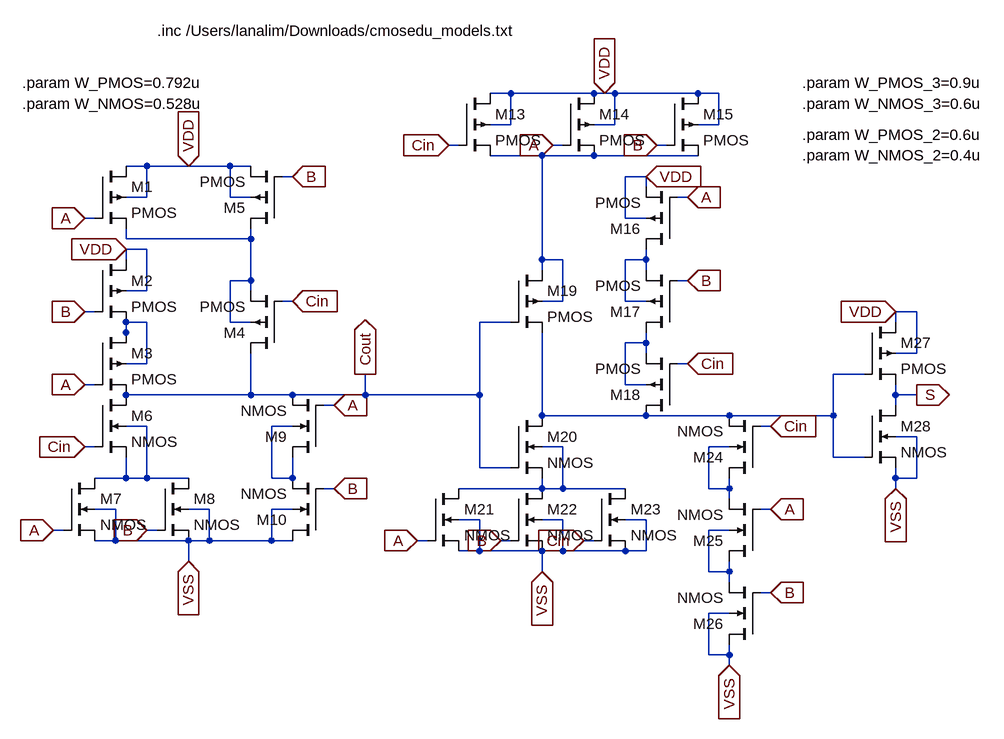
[diagram p0: schematic full_adder_2_even.asc]
full_adder_2_even.asc, the LTspice schematic file:
Version 4
SHEET 1 1372 1088
WIRE 448 -96 416 -96
WIRE 576 -96 448 -96
WIRE 592 -96 576 -96
WIRE 608 -96 592 -96
WIRE 736 -96 608 -96
WIRE 768 -96 736 -96
WIRE 448 -48 448 -96
WIRE 448 -48 416 -48
WIRE 608 -48 608 -96
WIRE 608 -48 576 -48
WIRE 768 -48 768 -96
WIRE 768 -48 736 -48
WIRE 368 -16 352 -16
WIRE 528 -16 512 -16
WIRE 688 -16 672 -16
WIRE 496 0 416 0
WIRE 576 0 496 0
WIRE 736 0 576 0
WIRE -112 16 -144 16
WIRE -48 16 -112 16
WIRE 16 16 -48 16
WIRE 48 16 16 16
WIRE 112 32 96 32
WIRE 656 32 624 32
WIRE 656 48 656 32
WIRE -112 64 -112 16
WIRE -112 64 -144 64
WIRE 16 64 16 16
WIRE 48 64 16 64
WIRE 720 64 704 64
WIRE -192 96 -208 96
WIRE 624 96 624 32
WIRE 656 96 624 96
WIRE -144 128 -144 112
WIRE 48 128 48 112
WIRE 48 128 -144 128
WIRE -112 144 -144 144
WIRE -144 160 -144 144
WIRE 496 160 496 0
WIRE 528 160 496 160
WIRE 656 160 656 144
WIRE 656 160 624 160
WIRE 496 176 496 160
WIRE 656 176 656 160
WIRE 48 192 48 128
WIRE 48 192 16 192
WIRE 720 192 704 192
WIRE -112 208 -112 144
WIRE -112 208 -144 208
WIRE 48 208 48 192
WIRE 112 224 96 224
WIRE 528 224 528 160
WIRE 528 224 496 224
WIRE 624 224 624 160
WIRE 656 224 624 224
WIRE -192 240 -208 240
WIRE 1072 240 1040 240
WIRE -112 256 -144 256
WIRE 16 256 16 192
WIRE 48 256 16 256
WIRE 448 256 400 256
WIRE 1040 256 1040 240
WIRE -144 272 -144 256
WIRE -144 288 -144 272
WIRE 656 288 656 272
WIRE 656 288 624 288
WIRE 656 304 656 288
WIRE 1072 304 1072 240
WIRE 1072 304 1040 304
WIRE -112 320 -112 256
WIRE -112 320 -144 320
WIRE 720 320 704 320
WIRE 992 336 944 336
WIRE -192 352 -208 352
WIRE 624 352 624 288
WIRE 656 352 624 352
WIRE 48 368 48 304
WIRE 48 368 -144 368
WIRE 112 368 48 368
WIRE 224 368 224 336
WIRE 224 368 112 368
WIRE 400 368 400 256
WIRE 400 368 224 368
WIRE 1040 368 1040 352
WIRE 1072 368 1040 368
WIRE 176 384 160 384
WIRE 1040 384 1040 368
WIRE 496 400 496 272
WIRE 656 400 496 400
WIRE 784 400 656 400
WIRE 944 400 944 336
WIRE 944 400 784 400
WIRE -112 416 -144 416
WIRE 112 416 80 416
WIRE 848 416 832 416
WIRE 1072 432 1040 432
WIRE -192 448 -208 448
WIRE 528 448 496 448
WIRE 784 448 752 448
WIRE 944 464 944 400
WIRE 992 464 944 464
WIRE 400 480 400 368
WIRE 448 480 400 480
WIRE -144 496 -144 464
WIRE -144 496 -192 496
WIRE -112 496 -112 416
WIRE -112 496 -144 496
WIRE -48 496 -112 496
WIRE 80 496 80 416
WIRE 112 496 112 464
WIRE 112 496 80 496
WIRE 1040 496 1040 480
WIRE 1072 496 1072 432
WIRE 1072 496 1040 496
WIRE 176 512 160 512
WIRE 496 512 496 496
WIRE 496 512 368 512
WIRE 528 512 528 448
WIRE 528 512 496 512
WIRE 624 512 528 512
WIRE 752 512 752 448
WIRE 784 512 784 496
WIRE 784 512 752 512
WIRE 1040 512 1040 496
WIRE 784 528 784 512
WIRE -160 544 -192 544
WIRE -16 544 -48 544
WIRE 112 544 80 544
WIRE 848 544 832 544
WIRE 400 560 368 560
WIRE 528 560 496 560
WIRE 656 560 624 560
WIRE -240 576 -256 576
WIRE -96 576 -112 576
WIRE 784 576 752 576
WIRE -160 592 -160 544
WIRE -160 592 -192 592
WIRE -48 592 -160 592
WIRE -16 592 -16 544
WIRE -16 592 -48 592
WIRE 80 592 80 544
WIRE 80 592 -16 592
WIRE 112 592 80 592
WIRE 320 592 304 592
WIRE 448 592 432 592
WIRE 576 592 560 592
WIRE 400 608 400 560
WIRE 400 608 368 608
WIRE 496 608 400 608
WIRE 528 608 528 560
WIRE 528 608 496 608
WIRE 624 608 528 608
WIRE 656 608 656 560
WIRE 656 608 624 608
WIRE -48 624 -48 592
WIRE 496 640 496 608
WIRE 752 640 752 576
WIRE 784 640 784 624
WIRE 784 640 752 640
WIRE 784 656 784 640
WIRE 848 672 832 672
WIRE 784 704 752 704
WIRE 752 768 752 704
WIRE 784 768 784 752
WIRE 784 768 752 768
WIRE 784 784 784 768
FLAG 592 -96 VDD
IOPIN 592 -96 In
FLAG 1040 240 VDD
IOPIN 1040 240 In
FLAG 1072 368 S
IOPIN 1072 368 Out
FLAG 352 -16 Cin
IOPIN 352 -16 In
FLAG 512 -16 A
IOPIN 512 -16 In
FLAG 672 -16 B
IOPIN 672 -16 In
FLAG 720 64 A
IOPIN 720 64 In
FLAG 720 192 B
IOPIN 720 192 In
FLAG 720 320 Cin
IOPIN 720 320 In
FLAG 304 592 A
IOPIN 304 592 In
FLAG 432 592 B
IOPIN 432 592 In
FLAG 560 592 Cin
IOPIN 560 592 In
FLAG 848 416 Cin
IOPIN 848 416 In
FLAG 848 544 A
IOPIN 848 544 In
FLAG 848 672 B
IOPIN 848 672 In
FLAG -208 96 A
IOPIN -208 96 In
FLAG -208 240 B
IOPIN -208 240 In
FLAG -208 352 A
IOPIN -208 352 In
FLAG 112 32 B
IOPIN 112 32 In
FLAG 112 224 Cin
IOPIN 112 224 In
FLAG -48 16 VDD
IOPIN -48 16 In
FLAG -208 448 Cin
IOPIN -208 448 In
FLAG -256 576 A
IOPIN -256 576 In
FLAG -112 576 B
IOPIN -112 576 In
FLAG 176 512 B
IOPIN 176 512 In
FLAG 176 384 A
IOPIN 176 384 In
FLAG 224 336 Cout
IOPIN 224 336 Out
FLAG -48 624 VSS
IOPIN -48 624 In
FLAG 496 640 VSS
IOPIN 496 640 In
FLAG 784 784 VSS
IOPIN 784 784 In
FLAG 1040 512 VSS
IOPIN 1040 512 In
FLAG -144 144 VDD
IOPIN -144 144 In
FLAG 656 32 VDD
IOPIN 656 32 In
SYMBOL pmos4 368 -96 R0
SYMATTR InstName M13
SYMATTR Value2 l=1e-7 w={W_PMOS_2}
SYMBOL pmos4 528 -96 R0
SYMATTR InstName M14
SYMATTR Value2 l=1e-7 w={W_PMOS_2}
SYMBOL pmos4 688 -96 R0
SYMATTR InstName M15
SYMATTR Value2 l=1e-7 w={W_PMOS_2}
SYMBOL pmos4 704 144 R180
SYMATTR InstName M16
SYMATTR Value2 l=1e-7 w={W_PMOS_3}
SYMBOL pmos4 704 272 R180
SYMATTR InstName M17
SYMATTR Value2 l=1e-7 w={W_PMOS_3}
SYMBOL pmos4 704 400 R180
SYMATTR InstName M18
SYMATTR Value2 l=1e-7 w={W_PMOS_3}
SYMBOL pmos4 448 176 R0
SYMATTR InstName M19
SYMATTR Value2 l=1e-7 w={W_PMOS_2}
SYMBOL nmos4 448 400 R0
SYMATTR InstName M20
SYMATTR Value2 l=1e-7 w={W_NMOS_2}
SYMBOL nmos4 320 512 R0
SYMATTR InstName M21
SYMATTR Value2 l=1e-7 w={W_NMOS_2}
SYMBOL nmos4 448 512 R0
SYMATTR InstName M22
SYMATTR Value2 l=1e-7 w={W_NMOS_2}
SYMBOL nmos4 576 512 R0
SYMATTR InstName M23
SYMATTR Value2 l=1e-7 w={W_NMOS_2}
SYMBOL nmos4 832 496 R180
SYMATTR InstName M24
SYMATTR Value2 l=1e-7 w={W_NMOS_3}
SYMBOL nmos4 832 624 R180
SYMATTR InstName M25
SYMATTR Value2 l=1e-7 w={W_NMOS_3}
SYMBOL nmos4 832 752 R180
SYMATTR InstName M26
SYMATTR Value2 l=1e-7 w={W_NMOS_3}
SYMBOL pmos4 992 256 R0
SYMATTR InstName M27
SYMATTR Value2 l=1e-7 w=1045e-9
SYMBOL nmos4 992 384 R0
SYMATTR InstName M28
SYMATTR Value2 l=1e-7 w=696e-9
SYMBOL pmos4 -192 16 R0
SYMATTR InstName M1
SYMATTR Value2 l=1e-7 w={W_PMOS}
SYMBOL pmos4 -192 160 R0
SYMATTR InstName M2
SYMATTR Value2 l=1e-7 w={W_PMOS}
SYMBOL pmos4 -192 272 R0
SYMATTR InstName M3
SYMATTR Value2 l=1e-7 w={W_PMOS}
SYMBOL pmos4 96 304 R180
SYMATTR InstName M4
SYMATTR Value2 l=1e-7 w={W_PMOS}
SYMBOL pmos4 96 112 R180
SYMATTR InstName M5
SYMATTR Value2 l=1e-7 w={W_PMOS}
SYMBOL nmos4 -192 368 R0
SYMATTR InstName M6
SYMATTR Value2 l=1e-7 w={W_NMOS}
SYMBOL nmos4 -240 496 R0
SYMATTR InstName M7
SYMATTR Value2 l=1e-7 w={W_NMOS}
SYMBOL nmos4 -96 496 R0
SYMATTR InstName M8
SYMATTR Value2 l=1e-7 w={W_NMOS}
SYMBOL nmos4 160 464 R180
SYMATTR InstName M9
SYMATTR Value2 l=1e-7 w={W_NMOS}
SYMBOL nmos4 160 592 R180
SYMATTR InstName M10
SYMATTR Value2 l=1e-7 w={W_NMOS}
TEXT -96 -192 Left 2 !.inc /Users/lanalim/Downloads/cmosedu_models.txt
TEXT -304 -112 Left 2 !.param W_PMOS=0.792u
TEXT -304 -80 Left 2 !.param W_NMOS=0.528u
TEXT 896 -112 Left 2 !.param W_PMOS_3=0.9u
TEXT 896 -80 Left 2 !.param W_NMOS_3=0.6u
TEXT 896 -32 Left 2 !.param W_PMOS_2=0.6u\n.param W_NMOS_2=0.4u

The netlist it stands for:
* full_adder_2_even.asc
M13 VDD Cin N001 VDD PMOS l=1e-7 w={W_PMOS_2}
M14 VDD A N001 VDD PMOS l=1e-7 w={W_PMOS_2}
M15 VDD B N001 VDD PMOS l=1e-7 w={W_PMOS_2}
M16 N003 A VDD VDD PMOS l=1e-7 w={W_PMOS_3}
M17 N005 B N003 N003 PMOS l=1e-7 w={W_PMOS_3}
M18 N006 Cin N005 N005 PMOS l=1e-7 w={W_PMOS_3}
M19 N001 Cout N006 N001 PMOS l=1e-7 w={W_PMOS_2}
M20 N006 Cout N009 N009 NMOS l=1e-7 w={W_NMOS_2}
M21 N009 A VSS VSS NMOS l=1e-7 w={W_NMOS_2}
M22 N009 B VSS VSS NMOS l=1e-7 w={W_NMOS_2}
M23 N009 Cin VSS VSS NMOS l=1e-7 w={W_NMOS_2}
M24 N010 Cin N006 N010 NMOS l=1e-7 w={W_NMOS_3}
M25 N011 A N010 N011 NMOS l=1e-7 w={W_NMOS_3}
M26 VSS B N011 VSS NMOS l=1e-7 w={W_NMOS_3}
M27 VDD N006 S VDD PMOS l=1e-7 w=1045e-9
M28 S N006 VSS VSS NMOS l=1e-7 w=696e-9
M1 VDD A N002 VDD PMOS l=1e-7 w={W_PMOS}
M2 VDD B N004 VDD PMOS l=1e-7 w={W_PMOS}
M3 N004 A Cout N004 PMOS l=1e-7 w={W_PMOS}
M4 Cout Cin N002 N002 PMOS l=1e-7 w={W_PMOS}
M5 N002 B VDD VDD PMOS l=1e-7 w={W_PMOS}
M6 Cout Cin N007 N007 NMOS l=1e-7 w={W_NMOS}
M7 N007 A VSS VSS NMOS l=1e-7 w={W_NMOS}
M8 N007 B VSS VSS NMOS l=1e-7 w={W_NMOS}
M9 N008 A Cout N008 NMOS l=1e-7 w={W_NMOS}
M10 VSS B N008 VSS NMOS l=1e-7 w={W_NMOS}
.model NMOS NMOS
.model PMOS PMOS
.lib standard.mos
.inc /Users/lanalim/Downloads/cmosedu_models.txt
.param W_PMOS=0.792u
.param W_NMOS=0.528u
.param W_PMOS_3=0.9u
.param W_NMOS_3=0.6u
.param W_PMOS_2=0.6u
.param W_NMOS_2=0.4u
.backanno
.end